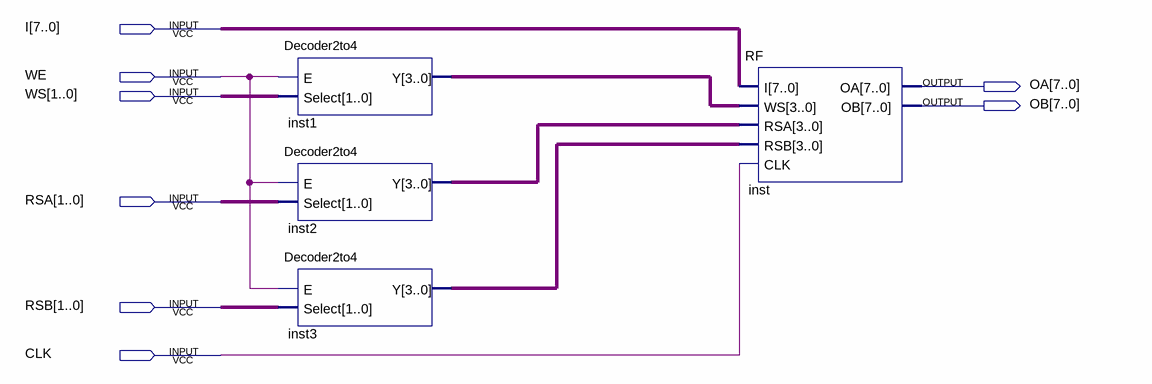
[diagram p0: schematic sheet]
// Quartus schematic RegisterFile.bdf as structural Verilog: 4 symbols, 8 pins
module RegisterFile (
  input  [7:0] I,
  input  WE,
  input  [1:0] WS,
  input  [1:0] RSA,
  input  [1:0] RSB,
  input  CLK,
  output [7:0] OA,
  output [7:0] OB
);

  wire [3:0] inst1_y, inst2_y, inst3_y;

  Decoder2to4 inst1 (.E(WE), .Select(WS), .Y(inst1_y));
  Decoder2to4 inst2 (.E(WE), .Select(RSA), .Y(inst2_y));
  Decoder2to4 inst3 (.E(WE), .Select(RSB), .Y(inst3_y));
  RF inst (.RSB(inst3_y), .RSA(inst2_y), .WS(inst1_y), .I(I), .CLK(CLK), .OA(OA), .OB(OB));
endmodule
